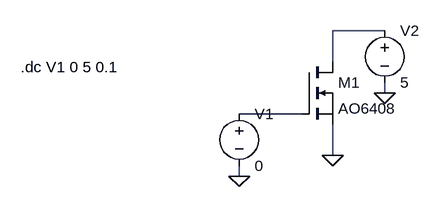
[diagram p0: schematic Draft2.asc]
Draft2.asc, the LTspice schematic file:
Version 4.1
SHEET 1 880 680
WIRE 368 48 288 48
WIRE 288 96 288 48
WIRE 368 144 368 128
WIRE 240 176 144 176
WIRE 288 240 288 192
WIRE 144 272 144 256
FLAG 288 240 0
FLAG 144 272 0
FLAG 368 144 0
SYMBOL nmos 240 96 R0
SYMATTR InstName M1
SYMATTR Value AO6408
SYMBOL voltage 144 160 R0
WINDOW 123 0 0 Left 0
WINDOW 39 0 0 Left 0
SYMATTR InstName V1
SYMATTR Value 0
SYMBOL voltage 368 32 R0
WINDOW 123 0 0 Left 0
WINDOW 39 0 0 Left 0
SYMATTR InstName V2
SYMATTR Value 5
TEXT -192 104 Left 2 !.dc V1 0 5 0.1

The netlist it stands for:
* Draft2.asc
M1 N001 N002 0 0 AO6408
V1 N002 0 0
V2 N001 0 5
.model NMOS NMOS
.model PMOS PMOS
.lib standard.mos
.dc V1 0 5 0.1
.backanno
.end